# Altium project vert.PrjPCB
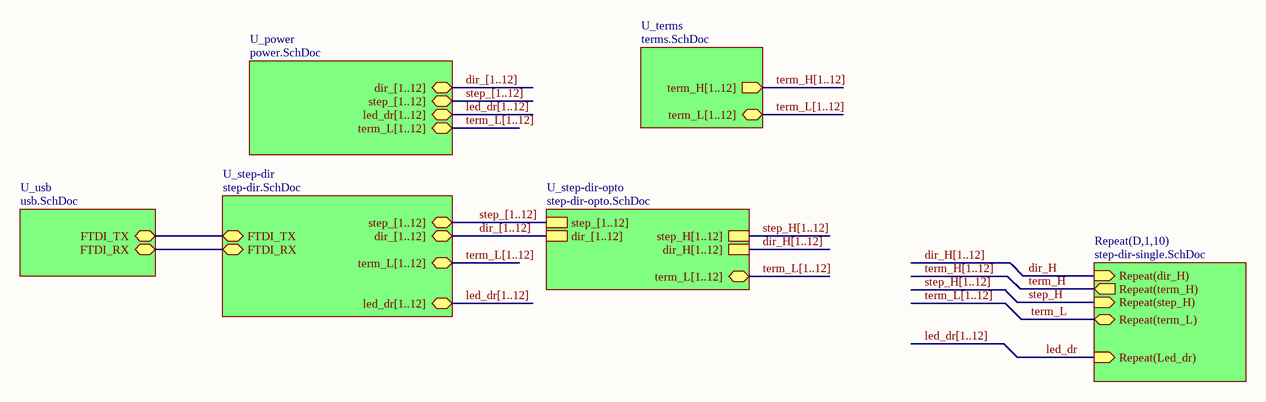
[diagram p0: top.SchDoc]
7 sheets, 219 parts. Net scope: hierarchical (ports join the sheet entries above them; power ports are global).
Board file: vert.PcbDoc
Sheets:
  top.SchDoc
    D1 = step-dir-single.SchDoc
    D2 = step-dir-single.SchDoc
    D3 = step-dir-single.SchDoc
    D4 = step-dir-single.SchDoc
    D5 = step-dir-single.SchDoc
    D6 = step-dir-single.SchDoc
    D7 = step-dir-single.SchDoc
    D8 = step-dir-single.SchDoc
    D9 = step-dir-single.SchDoc
    D10 = step-dir-single.SchDoc
    U_power = power.SchDoc
    U_step-dir = step-dir.SchDoc
    U_terms = terms.SchDoc
    U_usb = usb.SchDoc
    U_step-dir-opto = step-dir-opto.SchDoc

## Sheet top.SchDoc
size A4

### Sub-sheets
Repeat(D,1,10) = step-dir-single.SchDoc: Repeat(dir_H) (in), Repeat(step_H) (in), Repeat(term_H) (out), Repeat(Led_dr) (in), Repeat(term_L) (bidir)
U_power = power.SchDoc: dir_[1..12], step_[1..12], led_dr[1..12], term_L[1..12]
U_step-dir = step-dir.SchDoc: step_[1..12], dir_[1..12], FTDI_TX, FTDI_RX, led_dr[1..12], term_L[1..12]
U_step-dir-opto = step-dir-opto.SchDoc: step_[1..12], dir_[1..12], step_H[1..12], dir_H[1..12], term_L[1..12]
U_terms = terms.SchDoc: term_H[1..12] (out), term_L[1..12]
U_usb = usb.SchDoc: FTDI_RX, FTDI_TX

### Nets
dir_H: sheet Repeat(D,1,10)/Repeat(dir_H)
FTDI_RX: sheet U_step-dir/FTDI_RX, sheet U_usb/FTDI_RX
FTDI_TX: sheet U_step-dir/FTDI_TX, sheet U_usb/FTDI_TX
led_dr: sheet Repeat(D,1,10)/Repeat(Led_dr)
step_H: sheet Repeat(D,1,10)/Repeat(step_H)
term_H: sheet Repeat(D,1,10)/Repeat(term_H)
term_L: sheet Repeat(D,1,10)/Repeat(term_L)

### Buses and harness runs
bus dir_[1..12] = sheet U_power/dir_[1..12]
bus dir_[1..12] = sheet U_step-dir-opto/dir_[1..12] = sheet U_step-dir/dir_[1..12]
bus dir_H[1..12]
bus dir_H[1..12] = sheet U_step-dir-opto/dir_H[1..12]
bus led_dr[1..12]
bus led_dr[1..12] = sheet U_power/led_dr[1..12]
bus led_dr[1..12] = sheet U_step-dir/led_dr[1..12]
bus step_[1..12] = sheet U_power/step_[1..12]
bus step_[1..12] = sheet U_step-dir-opto/step_[1..12] = sheet U_step-dir/step_[1..12]
bus step_H[1..12]
bus step_H[1..12] = sheet U_step-dir-opto/step_H[1..12]
bus term_H[1..12]
bus term_H[1..12] = sheet U_terms/term_H[1..12]
bus term_L[1..12]
bus term_L[1..12] = sheet U_power/term_L[1..12]
bus term_L[1..12] = sheet U_step-dir-opto/term_L[1..12]
bus term_L[1..12] = sheet U_step-dir/term_L[1..12]
bus term_L[1..12] = sheet U_terms/term_L[1..12]

## Sheet step-dir-single.SchDoc
size A4
Used 10 times, as channels D1, D2, D3, D4, D5, D6, D7, D8, D9, D10. Parts and nets are listed once, with the designators drawn on the sheet.
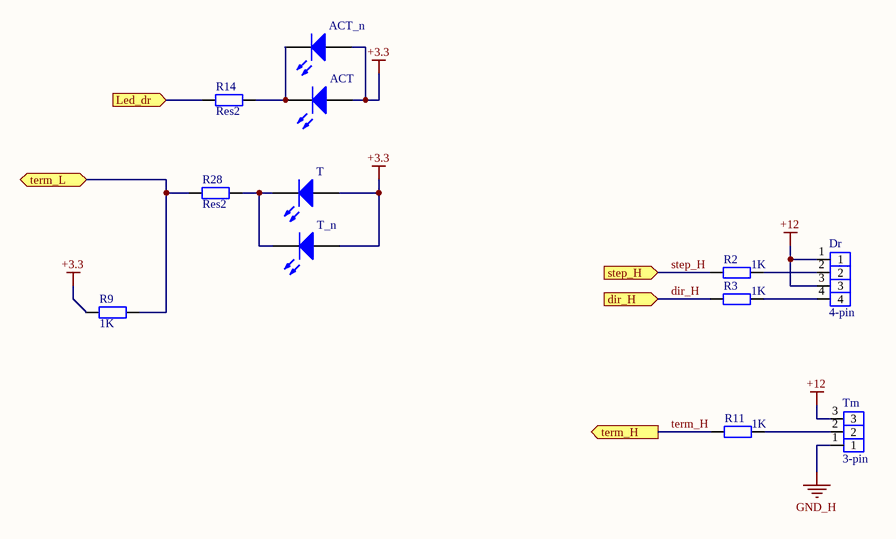
[diagram p1: step-dir-single.SchDoc]

### Parts
ACT  led  [CD2012-0805]  (value not drawn)
ACT_n  led  [led-pins]  (value not drawn)
Dr  4-pin  [CWF-4R]
R2  1K  [RESC2012M]
R3  1K  [RESC2012M]
R9  1K  [RESC2012M]
R11  1K  [RESC2012M]
R14  Res2  [RESC2012M]
R28  Res2  [RESC2012M]
T  led  [CD2012-0805]  (value not drawn)
T_n  led  [led-pins]  (value not drawn)
Tm  3-pin  [CWF-3R]

### Ports
dir_H (in), Led_dr (in), step_H (in), term_H (out), term_L (bidir)

### Nets
+3.3: ACT.1(A) ACT_n.1(A) R9.1 T.1(A) T_n.1(A)
+12: Dr.1 Dr.3 Tm.3
GND_H: Tm.1
dir_H: R3.1 ; port dir_H
Led_dr: R14.1 ; port Led_dr
step_H: R2.1 ; port step_H
term_H: R11.1 ; port term_H
term_L: R9.2 R28.1 ; port term_L
NetACT_2: ACT.2(K) ACT_n.2(K) R14.2
NetDr_2: Dr.2 R2.2
NetDr_4: Dr.4 R3.2
NetR11_2: R11.2 Tm.2
NetR28_2: R28.2 T.2(K) T_n.2(K)

### Channels
D1: designators end in _D1; ports dir_H=dir_H Led_dr=LED_DR1 step_H=step_H term_H=term_H term_L=term_L1
D2: designators end in _D2; ports dir_H=dir_H Led_dr=LED_DR2 step_H=step_H term_H=term_H term_L=term_L2
D3: designators end in _D3; ports dir_H=dir_H Led_dr=LED_DR3 step_H=step_H term_H=term_H term_L=term_L3
D4: designators end in _D4; ports dir_H=dir_H Led_dr=LED_DR4 step_H=step_H term_H=term_H term_L=term_L4
D5: designators end in _D5; ports dir_H=dir_H Led_dr=LED_DR5 step_H=step_H term_H=term_H term_L=term_L5
D6: designators end in _D6; ports dir_H=dir_H Led_dr=LED_DR6 step_H=step_H term_H=term_H term_L=term_L6
D7: designators end in _D7; ports dir_H=dir_H Led_dr=LED_DR7 step_H=step_H term_H=term_H term_L=term_L7
D8: designators end in _D8; ports dir_H=dir_H Led_dr=LED_DR8 step_H=step_H term_H=term_H term_L=term_L8
D9: designators end in _D9; ports dir_H=dir_H Led_dr=LED_DR9 step_H=step_H term_H=term_H term_L=term_L9
D10: designators end in _D10; ports dir_H=dir_H Led_dr=LED_DR10 step_H=step_H term_H=term_H term_L=term_L10

### Library data of the parts
ACT ACT_n T T_n = chip led
R2 R3 R9 R11 = Res2: Resistor; Published: 8-Jun-2000; LatestRevisionDate: 17-Jul-2002; LatestRevisionNote: Re-released for DXP Platform.; PackageReference: AXIAL-0.4; Publisher: Altium Limited; PackageDescription: Axial Device, Thru-Hole; 2 Leads; 0.4 in Pin Spacing; Value: 1K
R14 R28 = Res2: Resistor; Value: 1K; Published: 8-Jun-2000; LatestRevisionDate: 17-Jul-2002; LatestRevisionNote: Re-released for DXP Platform.; PackageReference: AXIAL-0.4; Publisher: Altium Limited; PackageDescription: Axial Device, Thru-Hole; 2 Leads; 0.4 in Pin Spacing

## Sheet power.SchDoc: Power
size A4
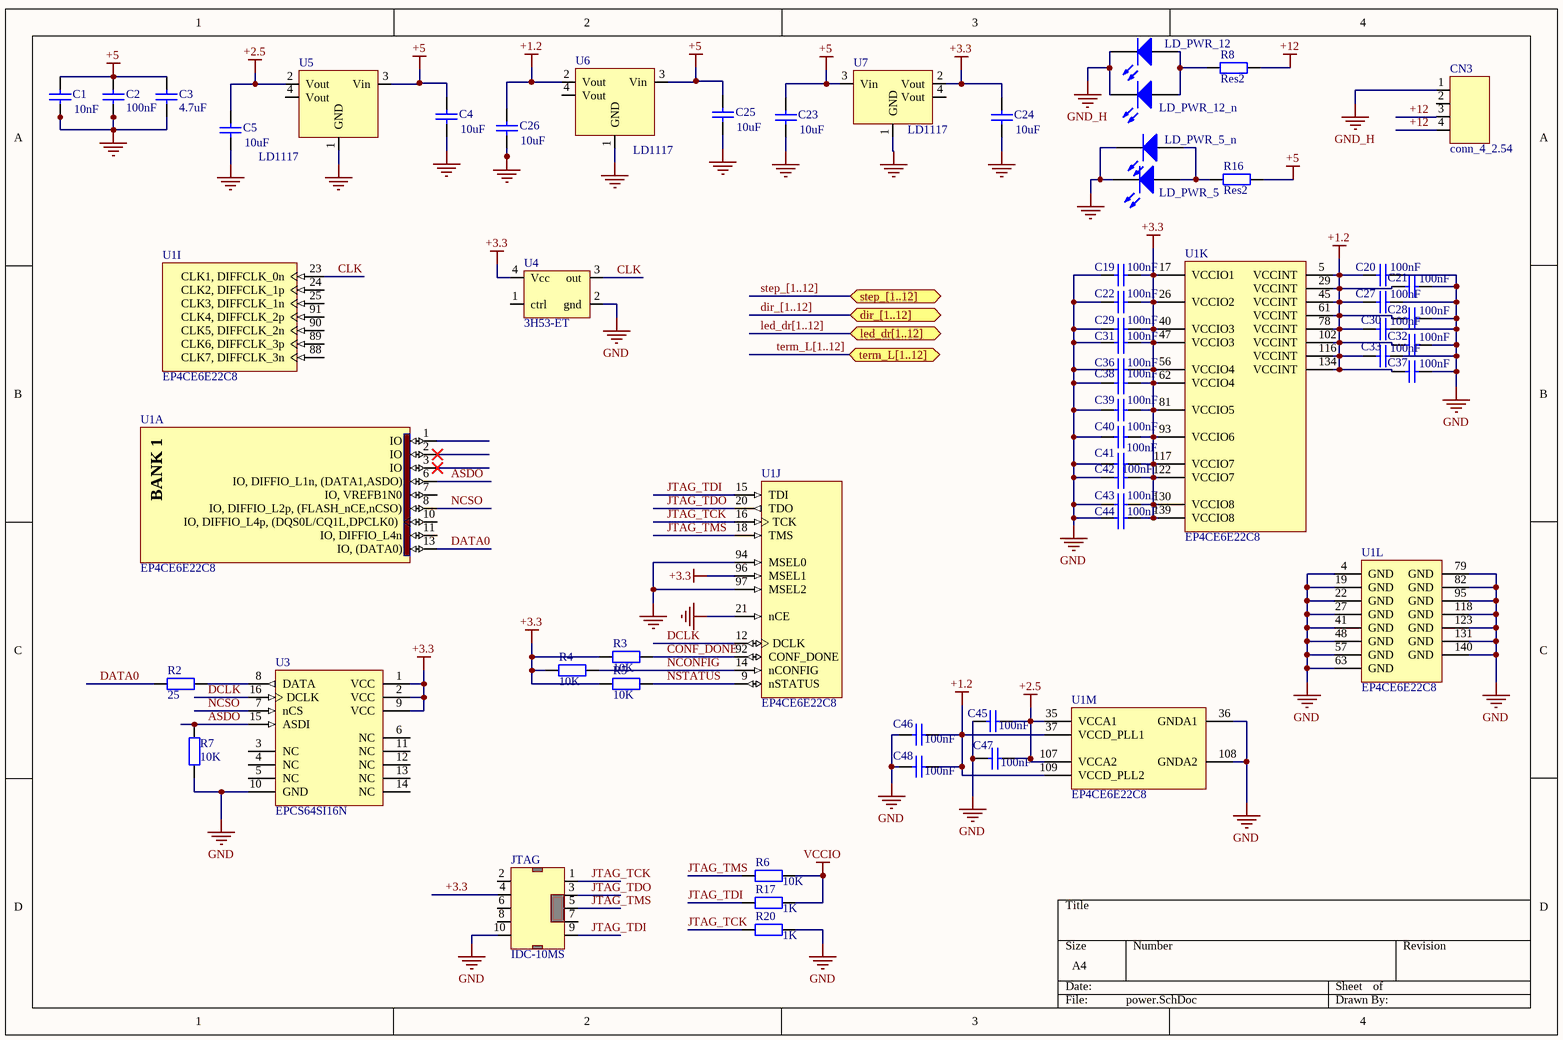
[diagram p2: power.SchDoc]

### Parts
C1  value 10nF  [CAPC1608M]  (hidden comment: Cap)
C2  value 100nF  [CAPC1608M]  (hidden comment: Cap)
C3  value 4.7uF  [CAPC1608M]  (hidden comment: Cap)
C4  value 10uF  [CAPC2012M]  (hidden comment: Cap)
C5  value 10uF  [CAPC2012M]  (hidden comment: Cap)
C19  value 100nF  [CAPC1608M]  (hidden comment: Cap)
C20  value 100nF  [CAPC1608M]  (hidden comment: Cap)
C21  value 100nF  [CAPC1608M]  (hidden comment: Cap)
C22  value 100nF  [CAPC1608M]  (hidden comment: Cap)
C23  value 10uF  [CAPC2012M]  (hidden comment: Cap)
C24  value 10uF  [CAPC2012M]  (hidden comment: Cap)
C25  value 10uF  [CAPC2012M]  (hidden comment: Cap)
C26  value 10uF  [CAPC2012M]  (hidden comment: Cap)
C27  value 100nF  [CAPC1608M]  (hidden comment: Cap)
C28  value 100nF  [CAPC1608M]  (hidden comment: Cap)
C29  value 100nF  [CAPC1608M]  (hidden comment: Cap)
C30  value 100nF  [CAPC1608M]  (hidden comment: Cap)
C31  value 100nF  [CAPC1608M]  (hidden comment: Cap)
C32  value 100nF  [CAPC1608M]  (hidden comment: Cap)
C33  value 100nF  [CAPC1608M]  (hidden comment: Cap)
C36  value 100nF  [CAPC1608M]  (hidden comment: Cap)
C37  value 100nF  [CAPC1608M]  (hidden comment: Cap)
C38  value 100nF  [CAPC1608M]  (hidden comment: Cap)
C39  value 100nF  [CAPC1608M]  (hidden comment: Cap)
C40  value 100nF  [CAPC1608M]  (hidden comment: Cap)
C41  value 100nF  [CAPC1608M]  (hidden comment: Cap)
C42  value 100nF  [CAPC1608M]  (hidden comment: Cap)
C43  value 100nF  [CAPC1608M]  (hidden comment: Cap)
C44  value 100nF  [CAPC1608M]  (hidden comment: Cap)
C45  value 100nF  [CAPC1608M]  (hidden comment: Cap)
C46  value 100nF  [CAPC1608M]  (hidden comment: Cap)
C47  value 100nF  [CAPC1608M]  (hidden comment: Cap)
C48  value 100nF  [CAPC1608M]  (hidden comment: Cap)
CN3  conn_4_2.54  [SCKT/SM4.5-2H4]
JTAG  IDC-10MS  [IDC2.54-V10D]
LD_PWR_5  led  [RESC2012M]  (value not drawn)
LD_PWR_5_n  led  [led-pins]  (value not drawn)
LD_PWR_12  led  [RESC2012M]  (value not drawn)
LD_PWR_12_n  led  [led-pins]  (value not drawn)
R2  25  [RESC2012M]
R3  10K  [RESC2012M]
R4  10K  [RESC2012M]
R5  10K  [RESC2012M]
R6  10K  [RESC2012M]
R7  value 10K  [RESC2012M]  (hidden comment: Res2)
R8  Res2  [RESC2012M]
R16  Res2  [RESC2012M]
R17  1K  [RESC2012M]
R20  1K  [RESC2012M]
U1  EP4CE6E22C8  [EQFP144_M]  (parts A,I,J,K,L,M of 13)
U3  EPCS64SI16N  [SOIC16_M]
U4  3H53-ET  [2SMX-3SMXB]
U5  LD1117  [SOT223-4M]
U6  LD1117  [SOT223-4M]
U7  LD1117  [SOT223-4M]

### Ports
dir_[1..12], led_dr[1..12], step_[1..12], term_L[1..12]

### Nets
+1.2: C20.1 C21.1 C26.1 C27.1 C28.1 C30.1 C32.1 C33.1 C37.1 C46.2 C48.2 U1.5(VCCINT) U1.29(VCCINT) U1.37(VCCD_PLL1) U1.45(VCCINT) U1.61(VCCINT) U1.78(VCCINT) U1.102(VCCINT) U1.109(VCCD_PLL2) U1.116(VCCINT) U1.134(VCCINT) U6.2(Vout)
+2.5: C5.1 C45.2 C47.2 U1.35(VCCA1) U1.107(VCCA2) U5.2(Vout)
+3.3: C19.2 C22.2 C24.1 C29.2 C31.2 C36.2 C38.2 C39.2 C40.2 C41.2 C42.2 C43.2 C44.2 JTAG.4 R3.1 R4.1 R5.1 U1.17(VCCIO1) U1.26(VCCIO2) U1.40(VCCIO3) U1.47(VCCIO3) U1.56(VCCIO4) U1.62(VCCIO4) U1.81(VCCIO5) U1.93(VCCIO6) U1.96(MSEL1) U1.117(VCCIO7) U1.122(VCCIO7) U1.130(VCCIO8) U1.139(VCCIO8) U3.1(VCC) U3.2(VCC) U3.9(VCC) U4.4(Vcc) U7.2(Vout)
+5: C1.1 C2.1 C3.1 C4.1 C23.1 C25.1 R16.2 U5.3(Vin) U6.3(Vin) U7.3(Vin)
+12: CN3.3 CN3.4 R8.2
GND: C1.2 C2.2 C3.2 C4.2 C5.2 C19.1 C20.2 C21.2 C22.1 C23.2 C24.2 C25.2 C26.2 C27.2 C28.2 C29.1 C30.2 C31.1 C32.2 C33.2 C36.1 C37.2 C38.1 C39.1 C40.1 C41.1 C42.1 C43.1 C44.1 C45.1 C46.1 C47.1 C48.1 JTAG.10 LD_PWR_5.2(K) LD_PWR_5_n.2(K) R7.1 R20.2 U1.4(GND) U1.19(GND) U1.21(nCE) U1.22(GND) U1.27(GND) U1.36(GNDA1) U1.41(GND) U1.48(GND) U1.57(GND) U1.63(GND) U1.79(GND) U1.82(GND) U1.94(MSEL0) U1.95(GND) U1.97(MSEL2) U1.108(GNDA2) U1.118(GND) U1.123(GND) U1.131(GND) U1.140(GND) U3.10(GND) U4.2(gnd) U5.1(GND) U6.1(GND) U7.1(GND)
GND_H: CN3.1 LD_PWR_12.2(K) LD_PWR_12_n.2(K)
VCCIO: R6.2 R17.2
ASDO: R7.2 U1.6(IO,_DIFFIO_L1n,_(DATA1,ASDO)) U3.15(ASDI)
CLK: U1.23(CLK1,_DIFFCLK_0n) U4.3(out)
CONF_DONE: R3.2 U1.92(CONF_DONE)
DATA0: R2.1 U1.13(IO,_(DATA0))
DCLK: U1.12(DCLK) U3.16(DCLK)
JTAG_TCK: JTAG.1 R20.1 U1.16(TCK)
JTAG_TDI: JTAG.9 R17.1 U1.15(TDI)
JTAG_TDO: JTAG.3 U1.20(TDO)
JTAG_TMS: JTAG.5 R6.1 U1.18(TMS)
NCONFIG: R4.2 U1.14(nCONFIG)
NCSO: U1.8(IO,_DIFFIO_L2p,_(FLASH_nCE,nCSO)) U3.7(nCS)
NSTATUS: R5.2 U1.9(nSTATUS)
NetLD_PWR_5_1: LD_PWR_5.1(A) LD_PWR_5_n.1(A) R16.1
NetLD_PWR_12_1: LD_PWR_12.1(A) LD_PWR_12_n.1(A) R8.1
NetR2_2: R2.2 U3.8(DATA)

Not connected (* = marked no-connect by the designer): CN3 2; JTAG 2 6 7 8; U1 1(IO) 2(IO)* 3(IO)* 7(IO,_VREFB1N0) 10(IO,_DIFFIO_L4p,_(DQS0L/CQ1L,DPCLK0)) 11(IO,_DIFFIO_L4n) 24(CLK2,_DIFFCLK_1p) 25(CLK3,_DIFFCLK_1n) 88(CLK7,_DIFFCLK_3n) 89(CLK6,_DIFFCLK_3p) 90(CLK5,_DIFFCLK_2n) 91(CLK4,_DIFFCLK_2p); U3 3(NC) 4(NC) 5(NC) 6(NC) 11(NC) 12(NC) 13(NC) 14(NC); U4 1(ctrl); U5 4(Vout); U6 4(Vout); U7 4(Vout)

### Buses and harness runs
bus dir_[1..12] = port dir_[1..12]
bus led_dr[1..12] = port led_dr[1..12]
bus step_[1..12] = port step_[1..12]
bus term_L[1..12] = port term_L[1..12]

### Notes on the sheet
- (in symbol EP4CE6E22C8, part A) BANK 1

### Library data of the parts
C1-C5 C19-C33 C36-C48 = Cap: Capacitor; Published: 8-Jun-2000; LatestRevisionDate: 17-Jul-2002; LatestRevisionNote: Re-released for DXP Platform.; PackageReference: RAD-0.3; Publisher: Altium Limited; PackageDescription: Radial Cap, Thru-Hole; 2 Leads; 0.3 in Pin Spacing
JTAG = BH-10(IDC-10MS)
LD_PWR_5 LD_PWR_5_n LD_PWR_12 LD_PWR_12_n = chip led
R2-R6 R8 R16 = Res2: Resistor; Value: 1K; Published: 8-Jun-2000; LatestRevisionDate: 17-Jul-2002; LatestRevisionNote: Re-released for DXP Platform.; PackageReference: AXIAL-0.4; Publisher: Altium Limited; PackageDescription: Axial Device, Thru-Hole; 2 Leads; 0.4 in Pin Spacing
R7 R17 R20 = Res2: Resistor; Published: 8-Jun-2000; LatestRevisionDate: 17-Jul-2002; LatestRevisionNote: Re-released for DXP Platform.; PackageReference: AXIAL-0.4; Publisher: Altium Limited; PackageDescription: Axial Device, Thru-Hole; 2 Leads; 0.4 in Pin Spacing
  R17 R20: Value: 1K
U1 = EP4CE6E22C8: Cyclone IV Family FPGA, 2V Core, 91 I/O Pins, 2 PLLs, 144-Pin QFP, Speed Grade 8, Commercial Grade; Published: 3-May-2010; DatasheetVersion: ver1.2, Mar-2010; PackageVersion: ver16.0, Dec-2009; PackageReference: EQFP144; Publisher: Altium Limited; PackageDescription: 144-Pin Plastic Enhanced Quad Flat Pack (EQFP144) - Wire Bond; Supplier 1: Digi-Key; Supplier Part Number 1: EP4CE6E22C8-ND; Code_JEDEC: MS-026-BFB; ComponentLink1Description: Manufacturer Link; ComponentLink1URL: http://www.altera.com/; ComponentLink2Description: Handbook; ComponentLink2URL: http://www.altera.com/literature/hb/cyclone-iv/cyclone4-handbook.pdf; ComponentLink3Description: Pinout Specification; ComponentLink3URL: http://www.altera.com/literature/lit-dp.jsp?category=cyc%204&showspreadsheet=y; ComponentLink4Description: Packaging Specification; ComponentLink4URL: http://www.altera.com/literature/ds/dspkg.pdf
U3 = EPCS64SI16N: EPCS64 Series, In-system programmable 3.3V serial configuration device, 16-Pin SOIC, 64-Megabit, Industrial Grade, Pb-Free; Configures: Cyclone II, Stratix II, & Cyclone Devices; Published: 4-Mar-2005; LatestRevisionDate: 13-Apr-2006; LatestRevisionNote: IPC-7351 Footprint Added.; DatasheetVersion: ver2.0, Oct-2003; PackageVersion: ver14.2, Oct-2005; PackageReference: SOIC16; Publisher: Altium Limited; PackageDescription: 16-Pin Small Outline Integrated Circuit Package (SOIC16); Supplier 1: Digi-Key; Supplier Part Number 1: 544-1380-5-ND; Code_JEDEC: MS-013-AA; Code_IPC: SOIC127P1030-16; ComponentLink1Description: Manufacturer Link; ComponentLink1URL: http://www.altera.com/products/devices/config/cfg-index.html; ComponentLink2Description: Configuration Handbook; ComponentLink2URL: http://www.altera.com/literature/hb/cfg/config_handbook.pdf; ComponentLink3Description: Pinout Specification; ComponentLink3URL: http://www.altera.com/literature/hb/cfg/config_handbook.pdf; ComponentLink4Description: Packaging Specification; ComponentLink4URL: http://www.altera.com/support/devices/packaging/specifications/pkg-pin/pdf/016-SOIC.pdf
U4 = 3H53-ET: Кварцевый генератор
U5 U6 = LD1086D2T: st LD1086D2T
U7 = ADP3339: ADP3339AKCZ-3.3-R7

## Sheet step-dir.SchDoc
size A4
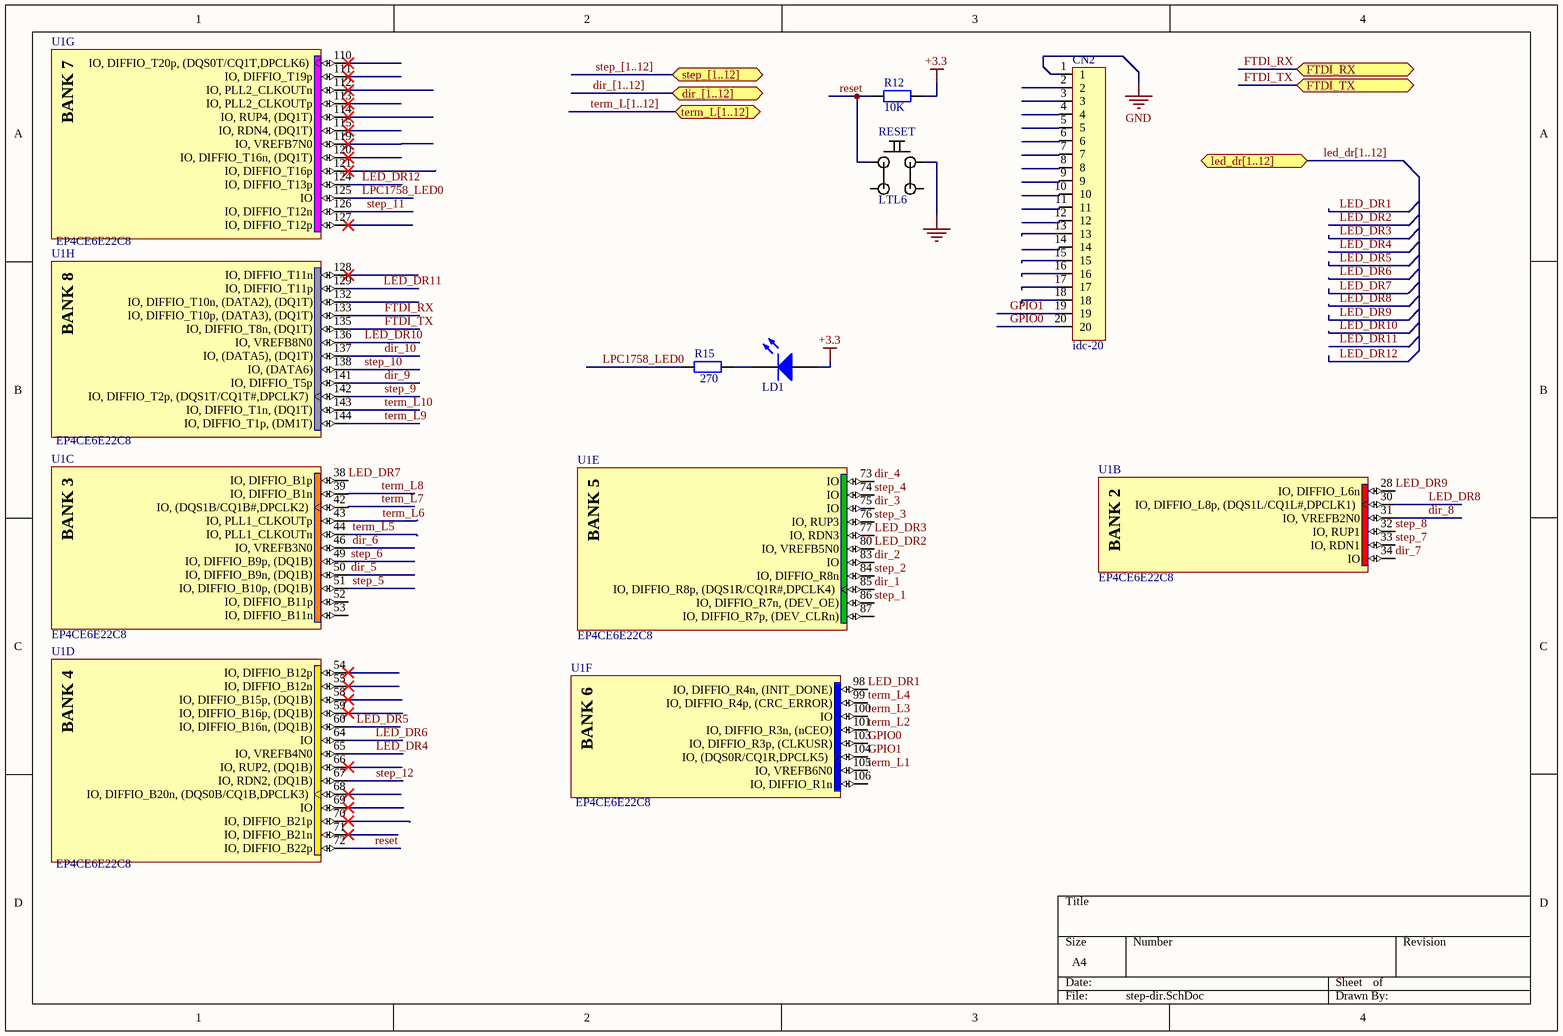
[diagram p3: step-dir.SchDoc]

### Parts
CN2  idc-20  [IDC2.54-V20C]
LD1  chip led  [RESC2012M]  (value not drawn)
R12  value 10K  [RESC2012M]  (hidden comment: Res2)
R15  value 270  [RESC2012M]  (hidden comment: Res2)
RESET  LTL6  [BUTTON - LTL6]
U1  EP4CE6E22C8  [EQFP144_M]  (parts B,C,D,E,F,G,H of 13)

### Ports
dir_[1..12], FTDI_RX, FTDI_TX, led_dr[1..12], step_[1..12], term_L[1..12]

### Nets
+3.3: LD1.1(A) R12.2
GND: CN2.1 RESET.1
dir_1: U1.85(IO,_DIFFIO_R8p,_(DQS1R/CQ1R#,DPCLK4))
dir_2: U1.83(IO)
dir_3: U1.75(IO)
dir_4: U1.73(IO)
dir_5: U1.50(IO,_DIFFIO_B9n,_(DQ1B))
dir_6: U1.46(IO,_VREFB3N0)
dir_7: U1.34(IO)
dir_8: U1.31(IO,_VREFB2N0)
dir_9: U1.141(IO,_DIFFIO_T5p)
dir_10: U1.137(IO,_(DATA5),_(DQ1T))
FTDI_RX: U1.133(IO,_DIFFIO_T10p,_(DATA3),_(DQ1T)) ; port FTDI_RX
FTDI_TX: U1.135(IO,_DIFFIO_T8n,_(DQ1T)) ; port FTDI_TX
GPIO0: CN2.20 U1.103(IO,_DIFFIO_R3p,_(CLKUSR))
GPIO1: CN2.19 U1.104(IO,_(DQS0R/CQ1R,DPCLK5))
LED_DR1: U1.98(IO,_DIFFIO_R4n,_(INIT_DONE))
LED_DR2: U1.80(IO,_VREFB5N0)
LED_DR3: U1.77(IO,_RDN3)
LED_DR4: U1.65(IO,_VREFB4N0)
LED_DR5: U1.60(IO,_DIFFIO_B16n,_(DQ1B))
LED_DR6: U1.64(IO)
LED_DR7: U1.38(IO,_DIFFIO_B1p)
LED_DR8: U1.30(IO,_DIFFIO_L8p,_(DQS1L/CQ1L#,DPCLK1))
LED_DR9: U1.28(IO,_DIFFIO_L6n)
LED_DR10: U1.136(IO,_VREFB8N0)
LED_DR11: U1.129(IO,_DIFFIO_T11p)
LED_DR12: U1.124(IO,_DIFFIO_T13p)
LPC1758_LED0: R15.1 U1.125(IO)
reset: R12.1 RESET.3 U1.72(IO,_DIFFIO_B22p)
step_1: U1.86(IO,_DIFFIO_R7n,_(DEV_OE))
step_2: U1.84(IO,_DIFFIO_R8n)
step_3: U1.76(IO,_RUP3)
step_4: U1.74(IO)
step_5: U1.51(IO,_DIFFIO_B10p,_(DQ1B))
step_6: U1.49(IO,_DIFFIO_B9p,_(DQ1B))
step_7: U1.33(IO,_RDN1)
step_8: U1.32(IO,_RUP1)
step_9: U1.142(IO,_DIFFIO_T2p,_(DQS1T/CQ1T#,DPCLK7))
step_10: U1.138(IO,_(DATA6))
step_11: U1.126(IO,_DIFFIO_T12n)
step_12: U1.67(IO,_RDN2,_(DQ1B))
term_L1: U1.105(IO,_VREFB6N0)
term_L2: U1.101(IO,_DIFFIO_R3n,_(nCEO))
term_L3: U1.100(IO)
term_L4: U1.99(IO,_DIFFIO_R4p,_(CRC_ERROR))
term_L5: U1.44(IO,_PLL1_CLKOUTn)
term_L6: U1.43(IO,_PLL1_CLKOUTp)
term_L7: U1.42(IO,_(DQS1B/CQ1B#,DPCLK2))
term_L8: U1.39(IO,_DIFFIO_B1n)
term_L9: U1.144(IO,_DIFFIO_T1p,_(DM1T))
term_L10: U1.143(IO,_DIFFIO_T1n,_(DQ1T))
NetLD1_2: LD1.2(K) R15.2

Not connected (* = marked no-connect by the designer): CN2 2 3 4 5 6 7 8 9 10 11 12 13 14 15 16 17 18; RESET 2 4; U1 52(IO,_DIFFIO_B11p) 53(IO,_DIFFIO_B11n) 54(IO,_DIFFIO_B12p)* 55(IO,_DIFFIO_B12n)* 58(IO,_DIFFIO_B15p,_(DQ1B))* 59(IO,_DIFFIO_B16p,_(DQ1B))* 66(IO,_RUP2,_(DQ1B))* 68(IO,_DIFFIO_B20n,_(DQS0B/CQ1B,DPCLK3))* 69(IO)* 70(IO,_DIFFIO_B21p)* 71(IO,_DIFFIO_B21n)* 87(IO,_DIFFIO_R7p,_(DEV_CLRn)) 106(IO,_DIFFIO_R1n) 110(IO,_DIFFIO_T20p,_(DQS0T/CQ1T,DPCLK6))* 111(IO,_DIFFIO_T19p)* 112(IO,_PLL2_CLKOUTn)* 113(IO,_PLL2_CLKOUTp)* 114(IO,_RUP4,_(DQ1T))* 115(IO,_RDN4,_(DQ1T))* 119(IO,_VREFB7N0)* 120(IO,_DIFFIO_T16n,_(DQ1T))* 121(IO,_DIFFIO_T16p)* 127(IO,_DIFFIO_T12p)* 128(IO,_DIFFIO_T11n)* 132(IO,_DIFFIO_T10n,_(DATA2),_(DQ1T))

### Buses and harness runs
bus dir_[1..12] = port dir_[1..12]
bus led_dr[1..12] = port led_dr[1..12]
bus step_[1..12] = port step_[1..12]
bus term_L[1..12] = port term_L[1..12]

### Notes on the sheet
- (in symbol EP4CE6E22C8, part B) BANK 2
- (in symbol EP4CE6E22C8, part C) BANK 3
- (in symbol EP4CE6E22C8, part D) BANK 4
- (in symbol EP4CE6E22C8, part E) BANK 5
- (in symbol EP4CE6E22C8, part F) BANK 6
- (in symbol EP4CE6E22C8, part G) BANK 7
- (in symbol EP4CE6E22C8, part H) BANK 8

### Library data of the parts
R12 R15 = Res2: Resistor; Published: 8-Jun-2000; LatestRevisionDate: 17-Jul-2002; LatestRevisionNote: Re-released for DXP Platform.; PackageReference: AXIAL-0.4; Publisher: Altium Limited; PackageDescription: Axial Device, Thru-Hole; 2 Leads; 0.4 in Pin Spacing
RESET = chip button LTL6
U1 = EP4CE6E22C8: as U1 on sheet power; Published: 3-May-2010; DatasheetVersion: ver1.2, Mar-2010; PackageVersion: ver16.0, Dec-2009; PackageReference: EQFP144; Publisher: Altium Limited; PackageDescription: 144-Pin Plastic Enhanced Quad Flat Pack (EQFP144) - Wire Bond; Supplier 1: Digi-Key; Supplier Part Number 1: EP4CE6E22C8-ND; Code_JEDEC: MS-026-BFB; ComponentLink1Description: Manufacturer Link; ComponentLink1URL: http://www.altera.com/; ComponentLink2Description: Handbook; ComponentLink2URL: http://www.altera.com/literature/hb/cyclone-iv/cyclone4-handbook.pdf; ComponentLink3Description: Pinout Specification; ComponentLink3URL: http://www.altera.com/literature/lit-dp.jsp?category=cyc%204&showspreadsheet=y; ComponentLink4Description: Packaging Specification; ComponentLink4URL: http://www.altera.com/literature/ds/dspkg.pdf

## Sheet terms.SchDoc
size A4
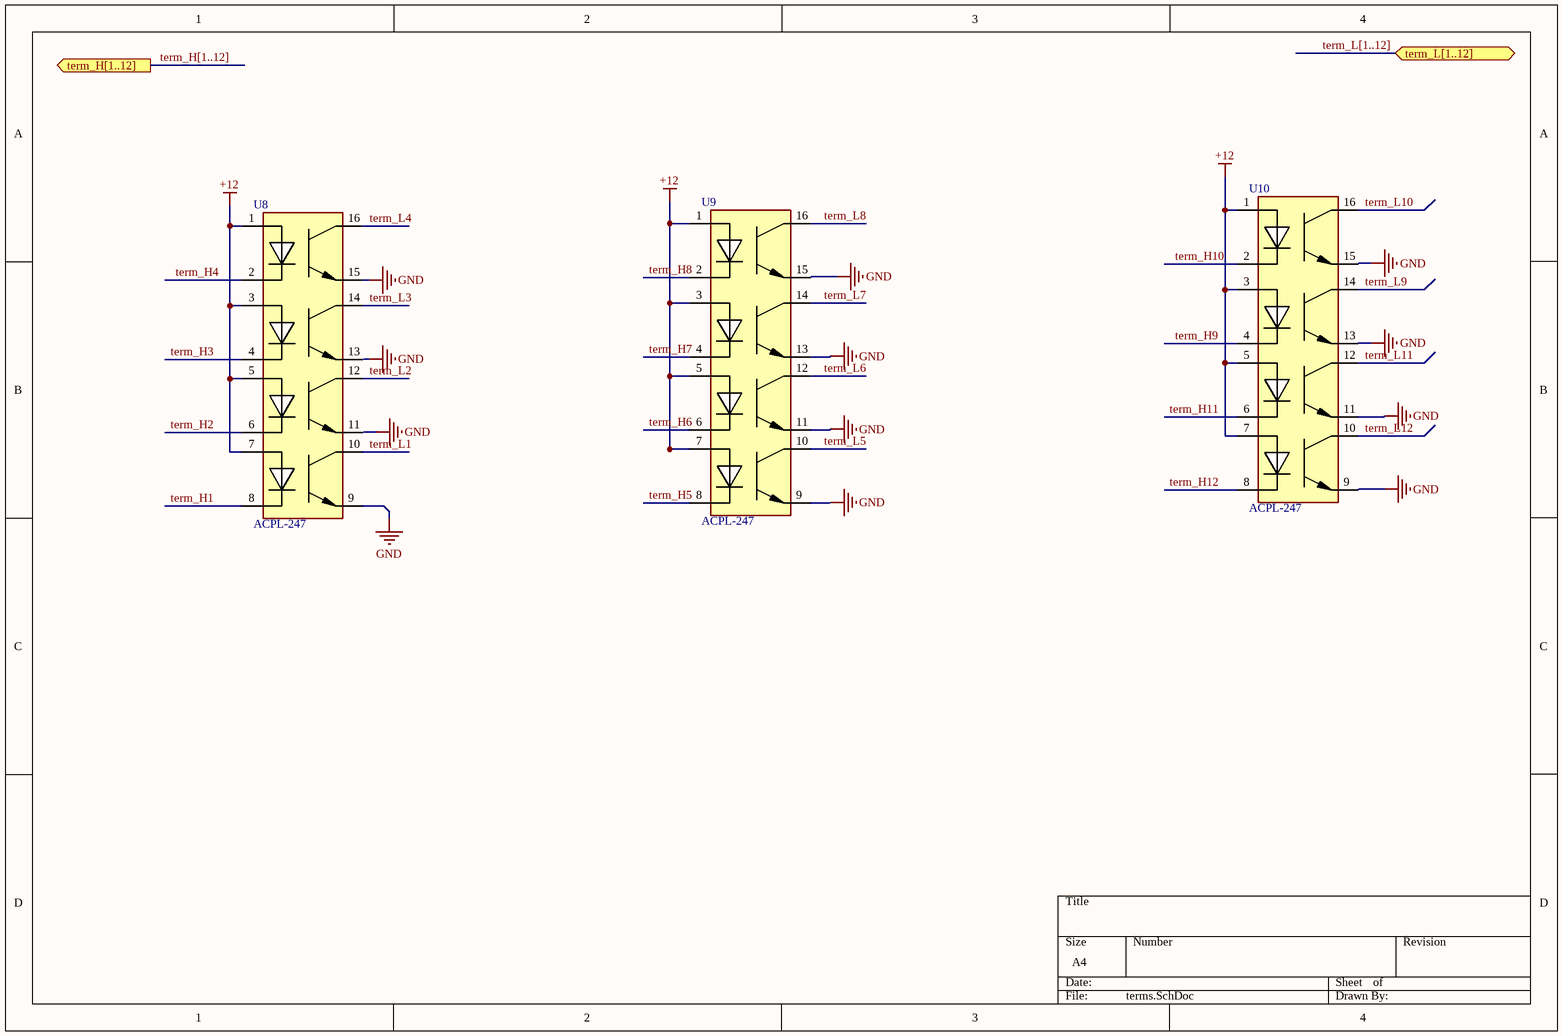
[diagram p4: terms.SchDoc]

### Parts
U8  ACPL-247  [SOIC127P600-16M]
U9  ACPL-247  [SOIC127P600-16M]
U10  ACPL-247  [SOIC127P600-16M]

### Ports
term_H[1..12] (out), term_L[1..12]

### Nets
+12: U8.1 U8.3 U8.5 U8.7 U9.1 U9.3 U9.5 U9.7 U10.1 U10.3 U10.5 U10.7
GND: U8.9 U8.11 U8.13 U8.15 U9.9 U9.11 U9.13 U9.15 U10.9 U10.11 U10.15
term_H1: U8.8  [project net term_H]
term_H2: U8.6  [project net term_H]
term_H3: U8.4  [project net term_H]
term_H4: U8.2  [project net term_H]
term_H5: U9.8  [project net term_H]
term_H6: U9.6  [project net term_H]
term_H7: U9.4  [project net term_H]
term_H8: U9.2  [project net term_H]
term_H9: U10.4  [project net term_H]
term_H10: U10.2  [project net term_H]
term_H11: U10.6
term_H12: U10.8
term_L1: U8.10
term_L2: U8.12
term_L3: U8.14
term_L4: U8.16
term_L5: U9.10
term_L6: U9.12
term_L7: U9.14
term_L8: U9.16
term_L9: U10.14
term_L10: U10.16
term_L11: U10.12
term_L12: U10.10

Not connected (* = marked no-connect by the designer): U10 13

### Buses and harness runs
bus term_H[1..12] = port term_H[1..12]
bus term_L[1..12] = port term_L[1..12]

### Library data of the parts
U8-U10 = ACPL-247: DC Input Multi-Channel Half-Pitch  Phototransistor Optocoupler

## Sheet usb.SchDoc
size A4
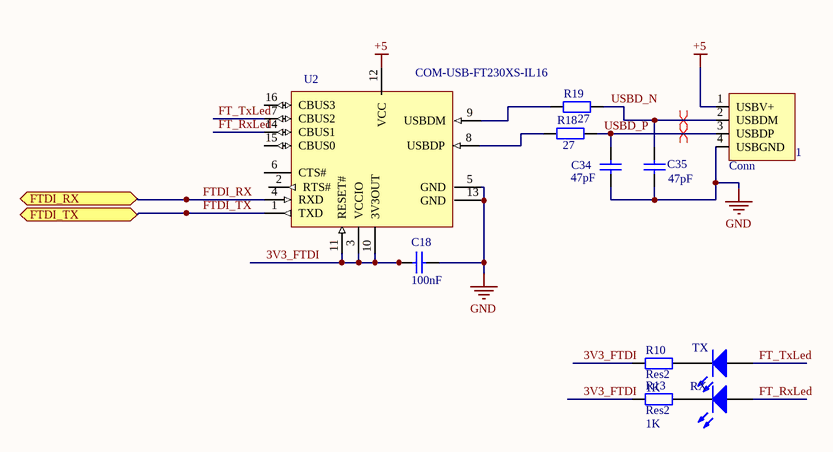
[diagram p5: usb.SchDoc]

### Parts
C18  value 100nF  [CAPC2012M]  (hidden comment: Cap)
C34  value 47pF  [CAPC1005M]  (hidden comment: Cap)
C35  value 47pF  [CAPC1005M]  (hidden comment: Cap)
CN1  Conn  AC Magnitude: 1  [USB2.5-2H4D]
R10  Res2  value 1K  [RESC2012M]
R13  Res2  value 1K  [RESC2012M]
R18  value 27  [RESC2012M]  (hidden comment: Res)
R19  value 27  [RESC2012M]  (hidden comment: Res)
RX  led  [RESC2012M]  (value not drawn)
TX  led  [RESC2012M]  (value not drawn)
U2  COM-USB-FT230XS-IL16  [SSOP-16_M]

### Ports
FTDI_RX, FTDI_TX

### Nets
+5: CN1.1(USBV+) U2.12(VCC)
GND: C18.2 C34.1 C35.1 CN1.4(USBGND) U2.5(GND) U2.13(GND)
3V3_FTDI: C18.1 R10.1 R13.1 U2.3(VCCIO) U2.10(3V3OUT) U2.11(RESET#)
FT_RxLed: RX.1(A) U2.14(CBUS1)
FT_TxLed: TX.1(A) U2.7(CBUS2)
FTDI_RX: U2.4(RXD) ; port FTDI_RX
FTDI_TX: U2.1(TXD) ; port FTDI_TX
USBD_N: C35.2 CN1.2(USBDM) R19.2
USBD_P: C34.2 CN1.3(USBDP) R18.2
NetR10_2: R10.2 TX.2(K)
NetR13_2: R13.2 RX.2(K)
NetR18_1: R18.1 U2.8(USBDP)
NetR19_1: R19.1 U2.9(USBDM)

Not connected (* = marked no-connect by the designer): U2 2(RTS#) 6(CTS#) 15(CBUS0) 16(CBUS3)

### Layout directives
differential pair: USBD_N, USBD_P

### Library data of the parts
C18 C34 C35 = Cap: Capacitor; Published: 8-Jun-2000; LatestRevisionDate: 17-Jul-2002; LatestRevisionNote: Re-released for DXP Platform.; PackageReference: RAD-0.3; Publisher: Altium Limited; PackageDescription: Radial Cap, Thru-Hole; 2 Leads; 0.3 in Pin Spacing
CN1 = USBB-1J: url: http://www.brownbear.ru/components/usbb-1j.html
R10 R13 R18 R19 = Res2: Resistor; Published: 8-Jun-2000; LatestRevisionDate: 17-Jul-2002; LatestRevisionNote: Re-released for DXP Platform.; PackageReference: AXIAL-0.4; Publisher: Altium Limited; PackageDescription: Axial Device, Thru-Hole; 2 Leads; 0.4 in Pin Spacing
RX TX = chip led
U2 = COM-USB-FT230XS-IL16: FTDI FT230XS

## Sheet step-dir-opto.SchDoc
size A4
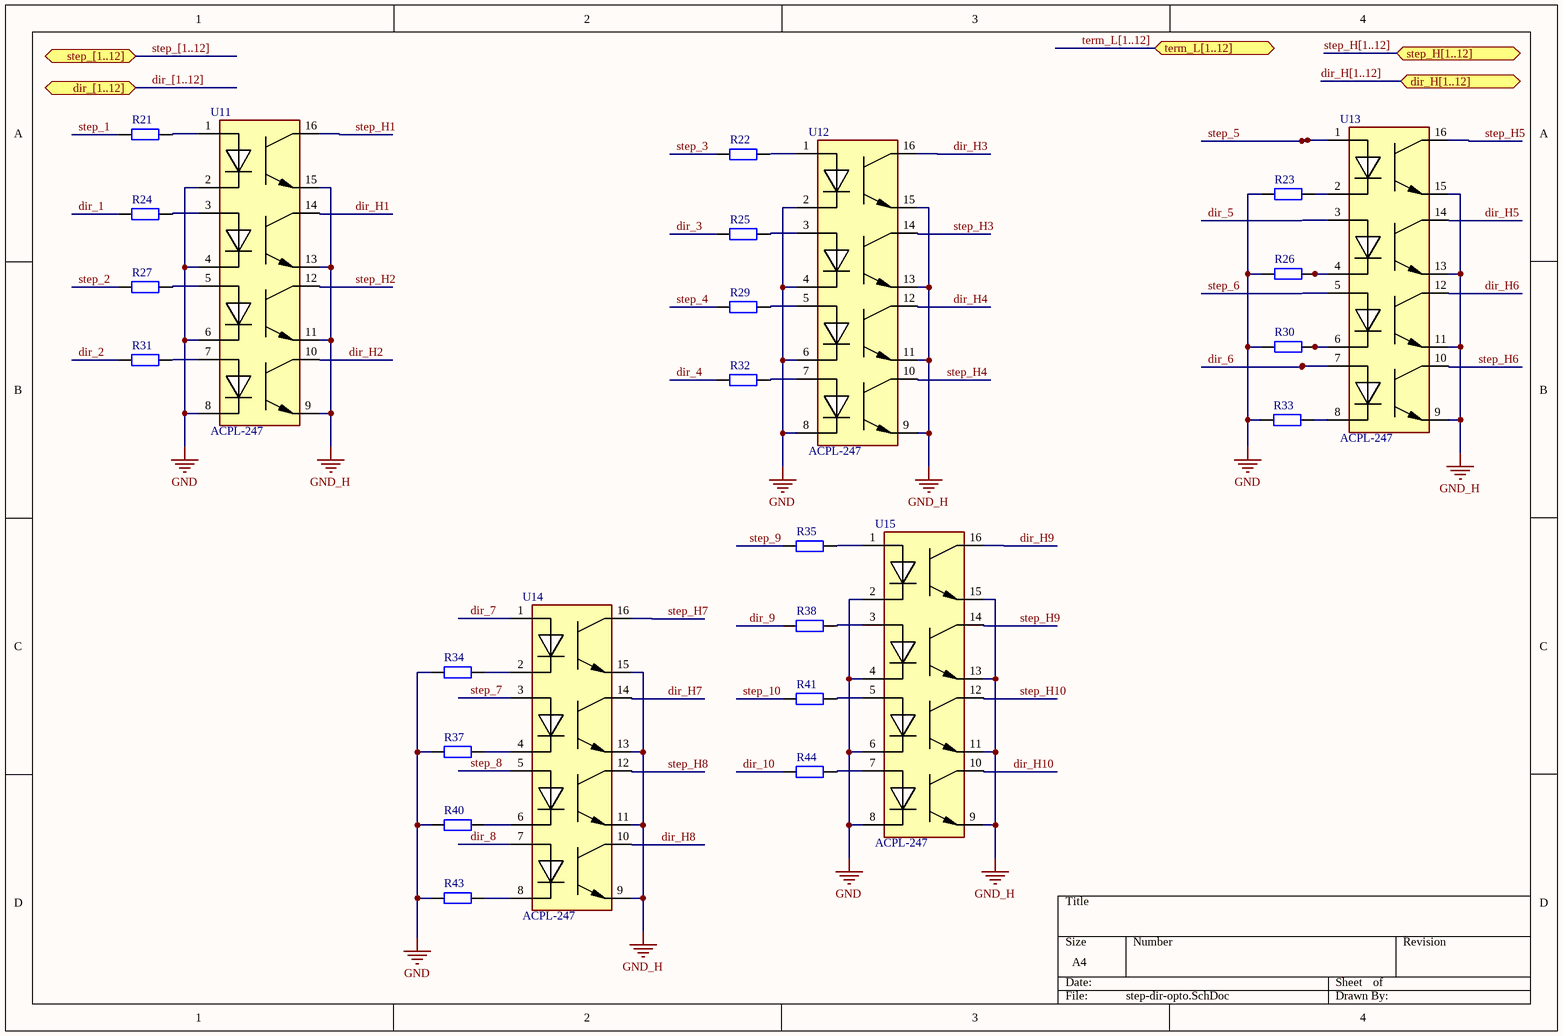
[diagram p6: step-dir-opto.SchDoc]

### Parts
R21  Res2  [RESC2012M]  (value not drawn)
R22  Res2  [RESC2012M]  (value not drawn)
R23  Res2  [RESC2012M]  (value not drawn)
R24  Res2  [RESC2012M]  (value not drawn)
R25  Res2  [RESC2012M]  (value not drawn)
R26  Res2  [RESC2012M]  (value not drawn)
R27  Res2  [RESC2012M]  (value not drawn)
R29  Res2  [RESC2012M]  (value not drawn)
R30  Res2  [RESC2012M]  (value not drawn)
R31  Res2  [RESC2012M]  (value not drawn)
R32  Res2  [RESC2012M]  (value not drawn)
R33  Res2  [RESC2012M]  (value not drawn)
R34  Res2  [RESC2012M]  (value not drawn)
R35  Res2  [RESC2012M]  (value not drawn)
R37  Res2  [RESC2012M]  (value not drawn)
R38  Res2  [RESC2012M]  (value not drawn)
R40  Res2  [RESC2012M]  (value not drawn)
R41  Res2  [RESC2012M]  (value not drawn)
R43  Res2  [RESC2012M]  (value not drawn)
R44  Res2  [RESC2012M]  (value not drawn)
U11  ACPL-247  [SOIC127P600-16M]
U12  ACPL-247  [SOIC127P600-16M]
U13  ACPL-247  [SOIC127P600-16M]
U14  ACPL-247  [SOIC127P600-16M]
U15  ACPL-247  [SOIC127P600-16M]

### Ports
dir_[1..12], dir_H[1..12], step_[1..12], step_H[1..12], term_L[1..12]

### Nets
GND: R23.1 R26.1 R30.1 R33.1 R34.1 R37.1 R40.1 R43.1 U11.2 U11.4 U11.6 U11.8 U12.2 U12.4 U12.6 U12.8 U15.2 U15.4 U15.6 U15.8
GND_H: U11.9 U11.11 U11.13 U11.15 U12.9 U12.11 U12.13 U12.15 U13.9 U13.11 U13.13 U13.15 U14.9 U14.11 U14.13 U14.15 U15.9 U15.11 U15.13 U15.15
dir_1: R24.1
dir_2: R31.1
dir_3: R25.1
dir_4: R32.1
dir_5: U13.3
dir_6: U13.7
dir_7: U14.1
dir_8: U14.7
dir_9: R38.1
dir_10: R44.1
dir_H1: U11.14  [project net dir_H]
dir_H2: U11.10  [project net dir_H]
dir_H3: U12.16  [project net dir_H]
dir_H4: U12.12  [project net dir_H]
dir_H5: U13.14  [project net dir_H]
dir_H6: U13.12  [project net dir_H]
dir_H7: U14.14  [project net dir_H]
dir_H8: U14.10  [project net dir_H]
dir_H9: U15.16  [project net dir_H]
dir_H10: U15.10  [project net dir_H]
step_1: R21.1
step_2: R27.1
step_3: R22.1
step_4: R29.1
step_5: U13.1
step_6: U13.5
step_7: U14.3
step_8: U14.5
step_9: R35.1
step_10: R41.1
step_H1: U11.16  [project net step_H]
step_H2: U11.12  [project net step_H]
step_H3: U12.14  [project net step_H]
step_H4: U12.10  [project net step_H]
step_H5: U13.16  [project net step_H]
step_H6: U13.10  [project net step_H]
step_H7: U14.16  [project net step_H]
step_H8: U14.12  [project net step_H]
step_H9: U15.14  [project net step_H]
step_H10: U15.12  [project net step_H]
NetR21_2: R21.2 U11.1
NetR22_2: R22.2 U12.1
NetR23_2: R23.2 U13.2
NetR24_2: R24.2 U11.3
NetR25_2: R25.2 U12.3
NetR26_2: R26.2 U13.4
NetR27_2: R27.2 U11.5
NetR29_2: R29.2 U12.5
NetR30_2: R30.2 U13.6
NetR31_2: R31.2 U11.7
NetR32_2: R32.2 U12.7
NetR33_2: R33.2 U13.8
NetR34_2: R34.2 U14.2
NetR35_2: R35.2 U15.1
NetR37_2: R37.2 U14.4
NetR38_2: R38.2 U15.3
NetR40_2: R40.2 U14.6
NetR41_2: R41.2 U15.5
NetR43_2: R43.2 U14.8
NetR44_2: R44.2 U15.7

### Buses and harness runs
bus dir_[1..12] = port dir_[1..12]
bus dir_H[1..12] = port dir_H[1..12]
bus step_[1..12] = port step_[1..12]
bus step_H[1..12] = port step_H[1..12]
bus term_L[1..12] = port term_L[1..12]

### Library data of the parts
R21-R27 R29-R35 R37 R38 R40 R41 R43 R44 = Res2: Resistor; Value: 1K; Published: 8-Jun-2000; LatestRevisionDate: 17-Jul-2002; LatestRevisionNote: Re-released for DXP Platform.; PackageReference: AXIAL-0.4; Publisher: Altium Limited; PackageDescription: Axial Device, Thru-Hole; 2 Leads; 0.4 in Pin Spacing
U11-U15 = ACPL-247: as U8 on sheet terms

## Nets that join several sheets
+3.3: D1 (5 pins), D2 (5 pins), D3 (5 pins), D4 (5 pins), D5 (5 pins), D6 (5 pins), D7 (5 pins), D8 (5 pins), D9 (5 pins), D10 (5 pins), power (35 pins), step-dir (LD1.1 R12.2)
+5: power (10 pins), usb (CN1.1 U2.12)
+12: D1 (Dr_D1.1 Dr_D1.3 Tm_D1.3), D2 (Dr_D2.1 Dr_D2.3 Tm_D2.3), D3 (Dr_D3.1 Dr_D3.3 Tm_D3.3), D4 (Dr_D4.1 Dr_D4.3 Tm_D4.3), D5 (Dr_D5.1 Dr_D5.3 Tm_D5.3), D6 (Dr_D6.1 Dr_D6.3 Tm_D6.3), D7 (Dr_D7.1 Dr_D7.3 Tm_D7.3), D8 (Dr_D8.1 Dr_D8.3 Tm_D8.3), D9 (Dr_D9.1 Dr_D9.3 Tm_D9.3), D10 (Dr_D10.1 Dr_D10.3 Tm_D10.3), power (CN3.3 CN3.4 R8.2), terms (12 pins)
GND: power (63 pins), step-dir (CN2.1 RESET.1), terms (11 pins), usb (6 pins), step-dir-opto (20 pins)
GND_H: D1 (Tm_D1.1), D2 (Tm_D2.1), D3 (Tm_D3.1), D4 (Tm_D4.1), D5 (Tm_D5.1), D6 (Tm_D6.1), D7 (Tm_D7.1), D8 (Tm_D8.1), D9 (Tm_D9.1), D10 (Tm_D10.1), power (CN3.1 LD_PWR_12.2 LD_PWR_12_n.2), step-dir-opto (20 pins)
dir_1: step-dir (U1.85), step-dir-opto (R24.1)
dir_2: step-dir (U1.83), step-dir-opto (R31.1)
dir_3: step-dir (U1.75), step-dir-opto (R25.1)
dir_4: step-dir (U1.73), step-dir-opto (R32.1)
dir_5: step-dir (U1.50), step-dir-opto (U13.3)
dir_6: step-dir (U1.46), step-dir-opto (U13.7)
dir_7: step-dir (U1.34), step-dir-opto (U14.1)
dir_8: step-dir (U1.31), step-dir-opto (U14.7)
dir_9: step-dir (U1.141), step-dir-opto (R38.1)
dir_10: step-dir (U1.137), step-dir-opto (R44.1)
dir_H: D1 (R3_D1.1), step-dir-opto (U11.14)
dir_H: D2 (R3_D2.1), step-dir-opto (U11.10)
dir_H: D3 (R3_D3.1), step-dir-opto (U12.16)
dir_H: D4 (R3_D4.1), step-dir-opto (U12.12)
dir_H: D5 (R3_D5.1), step-dir-opto (U13.14)
dir_H: D6 (R3_D6.1), step-dir-opto (U13.12)
dir_H: D7 (R3_D7.1), step-dir-opto (U14.14)
dir_H: D8 (R3_D8.1), step-dir-opto (U14.10)
dir_H: D9 (R3_D9.1), step-dir-opto (U15.16)
dir_H: D10 (R3_D10.1), step-dir-opto (U15.10)
FTDI_RX: step-dir (U1.133), usb (U2.4)
FTDI_TX: step-dir (U1.135), usb (U2.1)
LED_DR1: D1 (R14_D1.1), step-dir (U1.98)
LED_DR2: D2 (R14_D2.1), step-dir (U1.80)
LED_DR3: D3 (R14_D3.1), step-dir (U1.77)
LED_DR4: D4 (R14_D4.1), step-dir (U1.65)
LED_DR5: D5 (R14_D5.1), step-dir (U1.60)
LED_DR6: D6 (R14_D6.1), step-dir (U1.64)
LED_DR7: D7 (R14_D7.1), step-dir (U1.38)
LED_DR8: D8 (R14_D8.1), step-dir (U1.30)
LED_DR9: D9 (R14_D9.1), step-dir (U1.28)
LED_DR10: D10 (R14_D10.1), step-dir (U1.136)
step_1: step-dir (U1.86), step-dir-opto (R21.1)
step_2: step-dir (U1.84), step-dir-opto (R27.1)
step_3: step-dir (U1.76), step-dir-opto (R22.1)
step_4: step-dir (U1.74), step-dir-opto (R29.1)
step_5: step-dir (U1.51), step-dir-opto (U13.1)
step_6: step-dir (U1.49), step-dir-opto (U13.5)
step_7: step-dir (U1.33), step-dir-opto (U14.3)
step_8: step-dir (U1.32), step-dir-opto (U14.5)
step_9: step-dir (U1.142), step-dir-opto (R35.1)
step_10: step-dir (U1.138), step-dir-opto (R41.1)
step_H: D1 (R2_D1.1), step-dir-opto (U11.16)
step_H: D2 (R2_D2.1), step-dir-opto (U11.12)
step_H: D3 (R2_D3.1), step-dir-opto (U12.14)
step_H: D4 (R2_D4.1), step-dir-opto (U12.10)
step_H: D5 (R2_D5.1), step-dir-opto (U13.16)
step_H: D6 (R2_D6.1), step-dir-opto (U13.10)
step_H: D7 (R2_D7.1), step-dir-opto (U14.16)
step_H: D8 (R2_D8.1), step-dir-opto (U14.12)
step_H: D9 (R2_D9.1), step-dir-opto (U15.14)
step_H: D10 (R2_D10.1), step-dir-opto (U15.12)
term_H: D1 (R11_D1.1), terms (U8.8)
term_H: D2 (R11_D2.1), terms (U8.6)
term_H: D3 (R11_D3.1), terms (U8.4)
term_H: D4 (R11_D4.1), terms (U8.2)
term_H: D5 (R11_D5.1), terms (U9.8)
term_H: D6 (R11_D6.1), terms (U9.6)
term_H: D7 (R11_D7.1), terms (U9.4)
term_H: D8 (R11_D8.1), terms (U9.2)
term_H: D9 (R11_D9.1), terms (U10.4)
term_H: D10 (R11_D10.1), terms (U10.2)
term_L1: D1 (R9_D1.2 R28_D1.1), step-dir (U1.105), terms (U8.10)
term_L2: D2 (R9_D2.2 R28_D2.1), step-dir (U1.101), terms (U8.12)
term_L3: D3 (R9_D3.2 R28_D3.1), step-dir (U1.100), terms (U8.14)
term_L4: D4 (R9_D4.2 R28_D4.1), step-dir (U1.99), terms (U8.16)
term_L5: D5 (R9_D5.2 R28_D5.1), step-dir (U1.44), terms (U9.10)
term_L6: D6 (R9_D6.2 R28_D6.1), step-dir (U1.43), terms (U9.12)
term_L7: D7 (R9_D7.2 R28_D7.1), step-dir (U1.42), terms (U9.14)
term_L8: D8 (R9_D8.2 R28_D8.1), step-dir (U1.39), terms (U9.16)
term_L9: D9 (R9_D9.2 R28_D9.1), step-dir (U1.144), terms (U10.14)
term_L10: D10 (R9_D10.2 R28_D10.1), step-dir (U1.143), terms (U10.16)